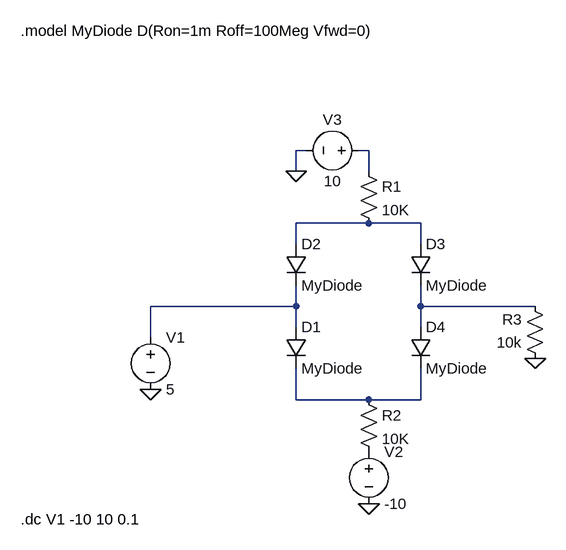
[diagram p0: schematic lab3_1.asc]
lab3_1.asc, the LTspice schematic file:
Version 4
SHEET 1 880 680
WIRE 32 -112 16 -112
WIRE 128 -112 112 -112
WIRE 16 -80 16 -112
WIRE 128 -80 128 -112
WIRE 128 0 16 0
WIRE 208 0 128 0
WIRE 16 32 16 0
WIRE 208 32 208 0
WIRE 16 128 16 96
WIRE 16 128 -208 128
WIRE 208 128 208 96
WIRE 384 128 208 128
WIRE 16 160 16 128
WIRE 208 160 208 128
WIRE -208 176 -208 128
WIRE 16 272 16 224
WIRE 128 272 16 272
WIRE 208 272 208 224
WIRE 208 272 128 272
FLAG -208 256 0
FLAG 128 432 0
FLAG 384 208 0
FLAG 16 -80 0
SYMBOL diode 0 160 R0
SYMATTR InstName D1
SYMATTR Value MyDiode
SYMBOL voltage -208 160 R0
WINDOW 123 0 0 Left 0
WINDOW 39 0 0 Left 0
SYMATTR InstName V1
SYMATTR Value 5
SYMBOL diode 0 32 R0
SYMATTR InstName D2
SYMATTR Value MyDiode
SYMBOL diode 192 32 R0
SYMATTR InstName D3
SYMATTR Value MyDiode
SYMBOL diode 192 160 R0
SYMATTR InstName D4
SYMATTR Value MyDiode
SYMBOL res 112 -96 R0
SYMATTR InstName R1
SYMATTR Value 10K
SYMBOL res 112 256 R0
SYMATTR InstName R2
SYMATTR Value 10K
SYMBOL res 400 224 R180
WINDOW 0 36 76 Left 2
WINDOW 3 36 40 Left 2
SYMATTR InstName R3
SYMATTR Value 10k
SYMBOL voltage 128 336 R0
WINDOW 123 0 0 Left 0
WINDOW 39 0 0 Left 0
SYMATTR InstName V2
SYMATTR Value -10
SYMBOL voltage 128 -112 R90
WINDOW 0 -32 56 VBottom 2
WINDOW 3 32 56 VTop 2
WINDOW 123 0 0 Left 0
WINDOW 39 0 0 Left 0
SYMATTR InstName V3
SYMATTR Value 10
TEXT -408 -296 Left 2 !.model MyDiode D(Ron=1m Roff=100Meg Vfwd=0)
TEXT -408 456 Left 2 !.dc V1 -10 10 0.1

The netlist it stands for:
* lab3_1.asc
D1 N003 N005 MyDiode
V1 N003 0 5
D2 N002 N003 MyDiode
D3 N002 N004 MyDiode
D4 N004 N005 MyDiode
R1 N001 N002 10K
R2 N005 P001 10K
R3 0 N004 10k
V2 P001 0 -10
V3 N001 0 10
.model D D
.lib standard.dio
.model MyDiode D(Ron=1m Roff=100Meg Vfwd=0)
.dc V1 -10 10 0.1
.backanno
.end